# Altium schematic sheet Motor Controllers.SchDoc
size B; DocumentNumber: 3; SheetNumber: 3; SheetTotal: 4
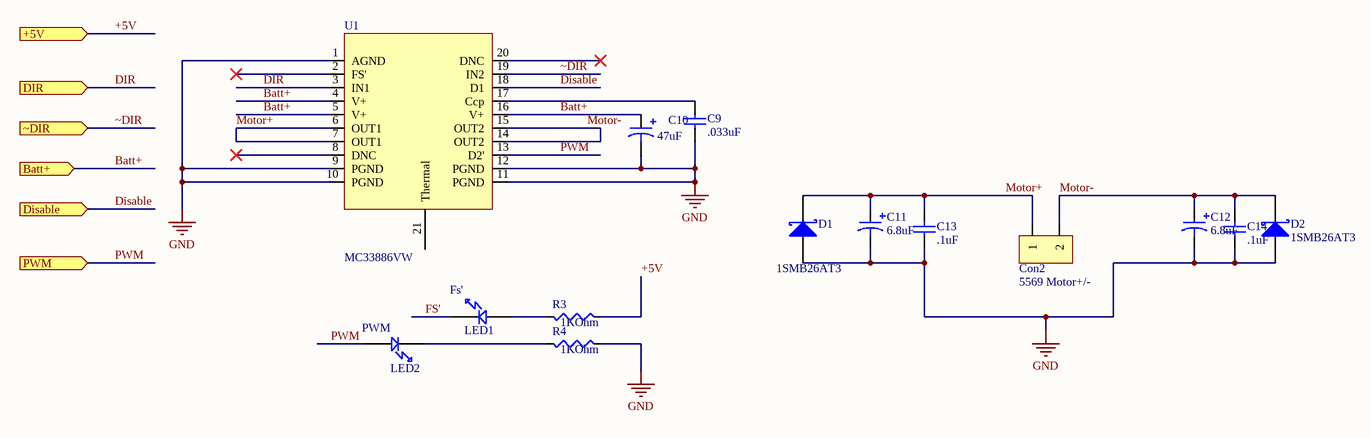
[diagram p0: Motor Controllers.SchDoc]

## Parts
C9  .033uF  [0805 (2012) Capacitor]
C10  47uF  [Radial_6.3mmDia_SM_D]
C11  6.8uF  [Radial_8mmDia_SM_E]
C12  6.8uF  [Radial_8mmDia_SM_E]
C13  .1uF  [0805 (2012) Capacitor]
C14  .1uF  [0805 (2012) Capacitor]
Con2  5569 Motor+/-  [5569 Mini-Fit Jr 2-Pos Right Angle w/ PCB Mounting Flange]
D1  1SMB26AT3  [SMB]
D2  1SMB26AT3  [SMB]
LED1  Fs'  [LED 0805]
LED2  PWM  [LED 0805]
R3  1KOhm  [R 0805 (2012) RESISTOR]
R4  1KOhm  [R 0805 (2012) RESISTOR]
U1  MC33886VW  [SOP127P1420X340_HS-20N]

## Ports
+5V (in), Batt+ (in), DIR (in), Disable (in), PWM (in), ~DIR (in)

## Nets
GND: C9.1 C10.N C11.N C12.N C13.1 C14.1 D1.1(A) D2.1(A) R4.2 U1.1(AGND) U1.9(PGND) U1.10(PGND) U1.11(PGND) U1.12(PGND)
+5V: R3.2 ; port +5V
Batt+: C10.P U1.4(V+) U1.5(V+) U1.16(V+) ; port Batt+
DIR: U1.3(IN1) ; port DIR
Disable: U1.18(D1) ; port Disable
FS': LED1.1
Motor+: C11.P C13.2 Con2.1 D1.2(K) U1.6(OUT1) U1.7(OUT1)
Motor-: C12.P C14.2 Con2.2 D2.2(K) U1.14(OUT2) U1.15(OUT2)
PWM: LED2.2 U1.13(D2') ; port PWM
~DIR: U1.19(IN2) ; port ~DIR
NetC9_2: C9.2 U1.17(Ccp)
NetLED1_2: LED1.2 R3.1
NetLED2_1: LED2.1 R4.1

Not connected (* = marked no-connect by the designer): U1 2(FS')* 8(DNC)* 20(DNC)* 21(Thermal)

## Library data of the parts
C9 = Capacitor (non-polarized): Capacitor; Value: .1uF
C10-C12 = Capacitor (polarized)
C13 C14 = Capacitor (non-polarized): Capacitor; Value: .1uF
Con2 = 5569 Mini-Fit Jr 2-Pos Right Angle
D1 D2 = D Schottky: Schottky Diode; Published: 8-Jun-2000; LatestRevisionDate: 17-Jul-2002; LatestRevisionNote: Re-released for DXP Platform.; PackageReference: SMB; Publisher: Altium Limited; Code_JEDEC: DO-214-AA
LED1 LED2 = LED: Standard LED
R3 R4 = Resistor: Value: 0Ohm
U1 = MC33886VW: Motor Controller